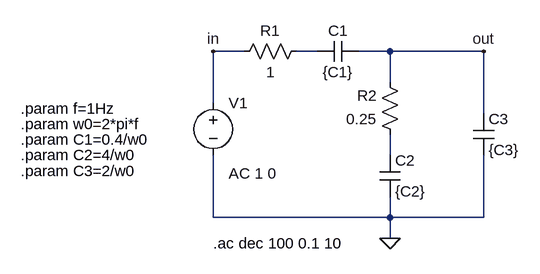
[diagram p0: schematic TS11_2.asc]
TS11_2.asc, the LTspice schematic file:
Version 4
SHEET 1 880 680
WIRE 96 112 48 112
WIRE 208 112 176 112
WIRE 320 112 272 112
WIRE 464 112 320 112
WIRE 320 160 320 112
WIRE 48 192 48 112
WIRE 464 208 464 112
WIRE 320 272 320 240
WIRE 48 368 48 272
WIRE 320 368 320 336
WIRE 320 368 48 368
WIRE 464 368 464 272
WIRE 464 368 320 368
WIRE 320 400 320 368
FLAG 320 400 0
FLAG 464 112 out
FLAG 48 112 in
SYMBOL res 192 96 R90
WINDOW 0 0 56 VBottom 2
WINDOW 3 32 56 VTop 2
SYMATTR InstName R1
SYMATTR Value 1
SYMBOL cap 272 96 R90
WINDOW 0 0 32 VBottom 2
WINDOW 3 32 32 VTop 2
SYMATTR InstName C1
SYMATTR Value {C1}
SYMBOL res 336 256 R180
WINDOW 0 36 76 Left 2
WINDOW 3 36 40 Left 2
SYMATTR InstName R2
SYMATTR Value 0.25
SYMBOL cap 304 272 R0
SYMATTR InstName C2
SYMATTR Value {C2}
SYMBOL cap 448 208 R0
SYMATTR InstName C3
SYMATTR Value {C3}
SYMBOL voltage 48 176 R0
WINDOW 123 24 124 Left 2
WINDOW 39 0 0 Left 0
SYMATTR Value2 AC 1 0
SYMATTR InstName V1
SYMATTR Value ""
TEXT -248 200 Left 2 !.param f=1Hz
TEXT -248 224 Left 2 !.param w0=2*pi*f
TEXT -248 248 Left 2 !.param C1=0.4/w0
TEXT -248 272 Left 2 !.param C2=4/w0
TEXT -248 296 Left 2 !.param C3=2/w0
TEXT 48 408 Left 2 !.ac dec 100 0.1 10

The netlist it stands for:
* TS11_2.asc
R1 N001 in 1
C1 out N001 {C1}
R2 N002 out 0.25
C2 N002 0 {C2}
C3 out 0 {C3}
V1 in 0 AC 1 0
.param f=1Hz
.param w0=2*pi*f
.param C1=0.4/w0
.param C2=4/w0
.param C3=2/w0
.ac dec 100 0.1 10
.backanno
.end